# EAGLE design layout (EAGLE 9.6.2)
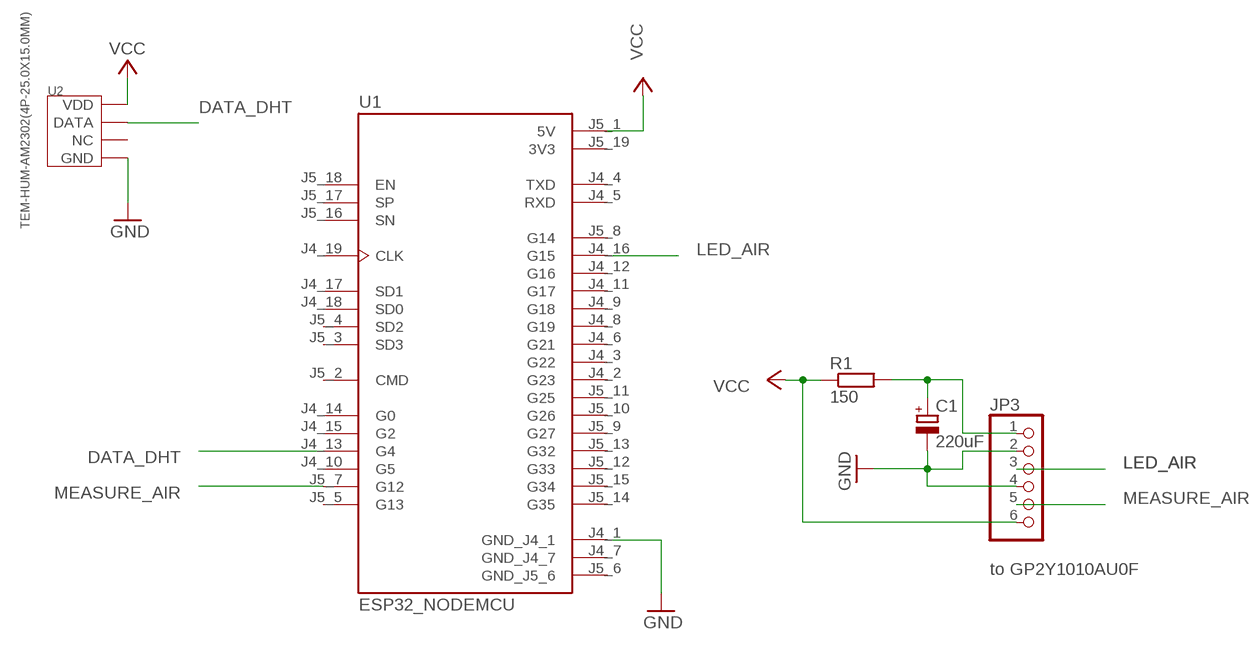
[diagram p0: schematic, sheet 1]

## Parts
C1  220uF  CPOL-EUE2-5  [E2-5]
JP3  to GP2Y1010AU0F  PINHD-1X6  [1X06]
R1  150  R-EU_0204/7  [0204/7]
U1  ESP32_NODEMCU  [MODULE_ESP32_NODEMCU]
U2  TEM-HUM-AM2302(4P-25.0X15.0MM)  [SNR4-2.54-25.0X15.0X7.0MM]

## Nets
DATA_DHT: U1.J4_13(G4) U2.P$2(DATA)
GND: C1.- JP3.2 JP3.4 U1.J4_1(GND_J4_1) U2.P$4(GND)
LED_AIR: JP3.3 U1.J4_16(G15)
MEASURE_AIR: JP3.5 U1.J5_7(G12)
N$2: C1.+ JP3.1 R1.2
VCC: JP3.6 R1.1 U1.J5_1(5V) U2.P$1(VDD)
Unconnected: U1.J4_2(G23) U1.J4_3(G22) U1.J4_4(TXD) U1.J4_5(RXD) U1.J4_6(G21) U1.J4_8(G19) U1.J4_9(G18) U1.J4_10(G5) U1.J4_11(G17) U1.J4_12(G16) U1.J4_14(G0) U1.J4_15(G2) U1.J4_17(SD1) U1.J4_18(SD0) U1.J4_19(CLK) U1.J5_2(CMD) U1.J5_3(SD3) U1.J5_4(SD2) U1.J5_5(G13) U1.J5_8(G14) U1.J5_9(G27) U1.J5_10(G26) U1.J5_11(G25) U1.J5_12(G33) U1.J5_13(G32) U1.J5_14(G35) U1.J5_15(G34) U1.J5_16(SN) U1.J5_17(SP) U1.J5_18(EN) U2.P$3(NC)

## Power pins joined to a net without a drawn wire
3V3: U1.J5_19(3V3)
GND_J4_7: U1.J4_7(GND_J4_7)
GND_J5_6: U1.J5_6(GND_J5_6)

## Library data of the parts
C1 = rcl:CPOL-EU: POLARIZED CAPACITOR, European symbol
JP3 = pinhead:PINHD-1X6: PIN HEADER
R1 = rcl:R-EU_: RESISTOR, European symbol
U1 = ESP32_NODEMCU:ESP32_NODEMCU: Check availability <https://pricing.snapeda.com/parts/ESP32%20NodeMCU/Espressif%20Systems/view-part?ref=eda>; AVAILABILITY: Not in stock; DESCRIPTION: NodeMCU is an open source loT platform. ESP32 is a series of low cost, low power system-on-chip (SoC) microcontrollers with integrated Wi-Fi & dual-mode Bluetooth.; MF: Espressif Systems; MP: ESP32 NodeMCU; OC_NEWARK: unknown; PACKAGE: Package; PRICE: None
U2 = TEM-HUM-AM2302_4P-25.0X15.0MM_:TEM-HUM-AM2302(4P-25.0X15.0MM): 314010001 Check availability <https://pricing.snapeda.com/parts/AM2302/MCM%20Electronics/view-part?ref=eda>; AVAILABILITY: Not in stock; DESCRIPTION: AM2302/DHT22 Humidity, Temperature Sensor mikroBUS™ Click™ Platform Evaluation Expansion Board; MF: MCM Electronics; MP: AM2302; OC_NEWARK: unknown; PACKAGE: Housed Sensor Seeed Technology; PRICE: None

## Board
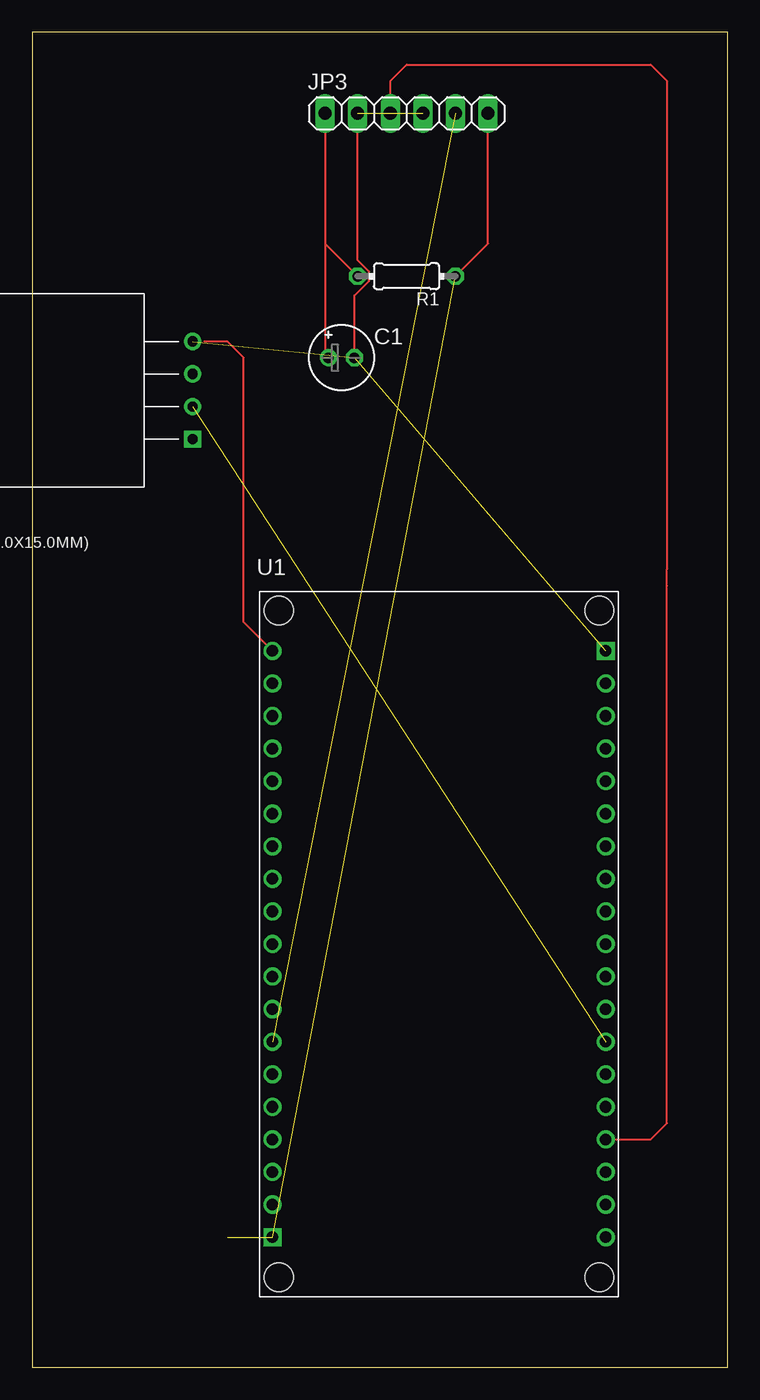
[diagram p1: board, top side]
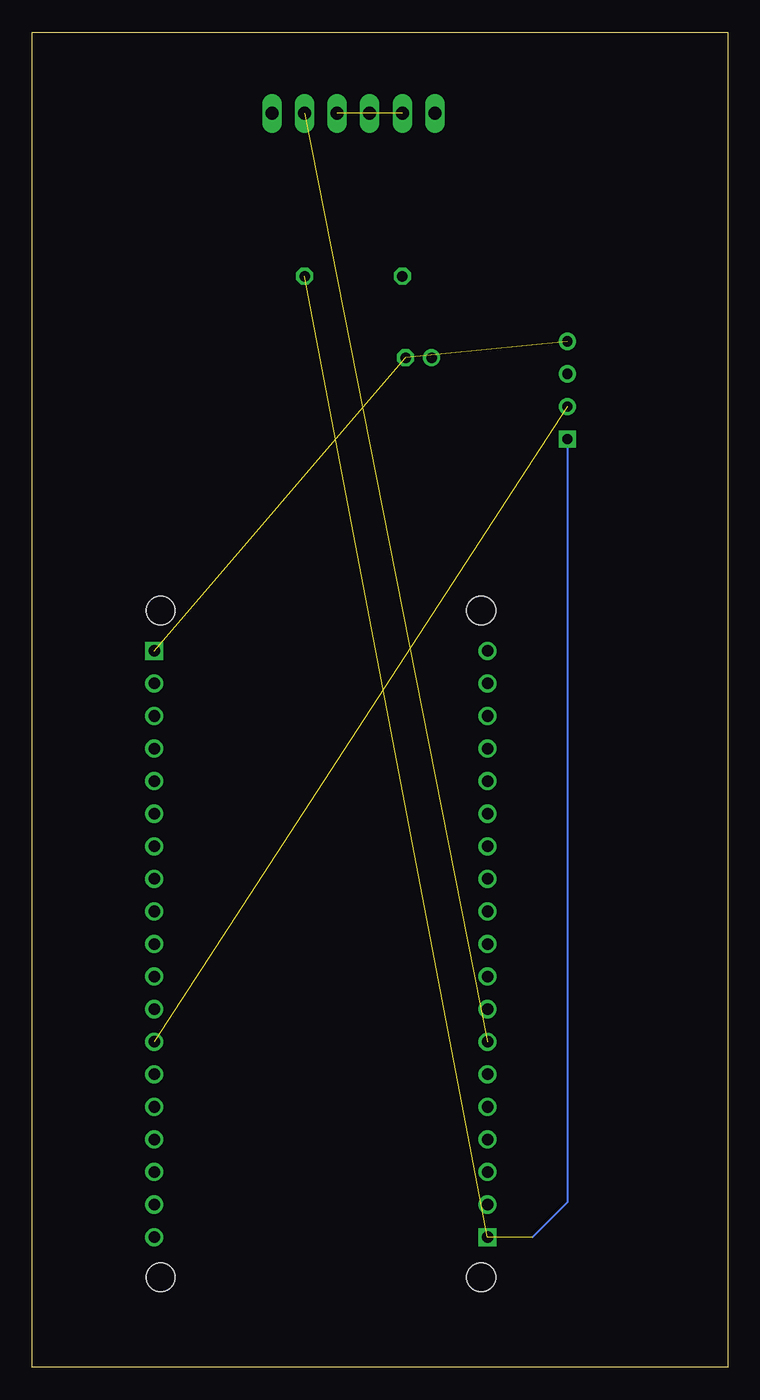
[diagram p2: board, bottom side, seen from below]

Size 54.28 x 104.13 mm. Coordinates in mm from the lower left corner, seen from the top.
Outline: 0,0 54.28,0 54.28,104.13 0,104.13 0,0
Copper layers (1*16): Top 0.035mm / dielectric 1.5mm / Bottom 0.035mm
Design rules "default": minimum track width 6mil, minimum drill 0.35mm, track to track 6mil, track to pad 6mil, pad to pad 6mil, via to via 6mil, smd to smd 6mil, copper to edge 40mil, drill to drill 6mil, minimum pad ring 10mil, minimum via ring 8mil, stop-mask expansion 4mil, vias tented up to drill 0mil, thermal gap 10mil

### Footprints (pad centres in the part's own frame; a part is rotated, then mirrored left to right if it is on the bottom)
E2-5 = drill 0.813 pad 1.27: + -1.016,0 | drill 0.813 pad 1.27 octagon: - 1.016,0
1X06 = drill 1.016 long: 1 -6.35,0; 2 -3.81,0; 3 -1.27,0; 4 1.27,0; 5 3.81,0; 6 6.35,0
0204/7 = drill 0.813 octagon: 1 -3.81,0; 2 3.81,0
MODULE_ESP32_NODEMCU = drill 0.9 pad 1.35 square: J4_1 13,22.86; J5_1 -13,-22.86 | drill 0.9 pad 1.35: J4_2 13,20.32; J4_3 13,17.78; J4_4 13,15.24; J4_5 13,12.7; J4_6 13,10.16; J4_7 13,7.62; J4_8 13,5.08; J4_9 13,2.54; J4_10 13,0; J4_11 13,-2.54; J4_12 13,-5.08; J4_13 13,-7.62; J4_14 13,-10.16; J4_15 13,-12.7; J4_16 13,-15.24; J4_17 13,-17.78; J4_18 13,-20.32; J4_19 13,-22.86; J5_2 -13,-20.32; J5_3 -13,-17.78; J5_4 -13,-15.24; J5_5 -13,-12.7; J5_6 -13,-10.16; J5_7 -13,-7.62; J5_8 -13,-5.08; J5_9 -13,-2.54; J5_10 -13,0; J5_11 -13,2.54; J5_12 -13,5.08; J5_13 -13,7.62; J5_14 -13,10.16; J5_15 -13,12.7; J5_16 -13,15.24; J5_17 -13,17.78; J5_18 -13,20.32; J5_19 -13,22.86 | hole 2.25: -12.5,-26; 12.5,-26; -12.5,26; 12.5,26
SNR4-2.54-25.0X15.0X7.0MM = drill 0.8 pad 1.35 square: P$1 -3.81,-13.8 | drill 0.8 pad 1.35: P$2 -1.27,-13.8; P$3 1.27,-13.8; P$4 3.81,-13.8

### Placement (x,y rotation side)
C1  24.13,78.74 0 top
JP3  29.21,97.79 0 top
R1  29.21,85.09 180 top
U1  31.75,33.02 0 top
U2  -1.27,76.2 90 top

### Tracks (layer width: path | path; a pad name or v marks a point on that pad's centre or on a via)
3V3
  Top 0.152: U1.J5_19 16.51,58.12 16.51,78.74 15.24,80.01 13.43,80.01
DATA_DHT  (1 unrouted)
GND  (3 unrouted)
  Top 0.152: C1.- 25.15,83.58 26.29,84.72 26.29,85.46 25.4,86.35 JP3.2
LED_AIR
  Top 0.152: U1.J4_16 48.26,17.78 49.53,19.05 49.53,60.96 49.53,62.23 49.53,100.33 48.26,101.6 29.21,101.6 27.94,100.33 JP3.3
MEASURE_AIR  (1 unrouted)
N$2
  Top 0.152: R1.2 22.86,87.63 JP3.1 22.86,78.99 C1.+
VCC  (2 unrouted)
  Top 0.152: R1.1 35.56,87.63 JP3.6
  Bottom 0.152: U2.P$1 12.53,12.87 15.24,10.16